# Altium schematic sheet Output.SchDoc
size Tabloid; SheetNumber: 4; SheetTotal: 5
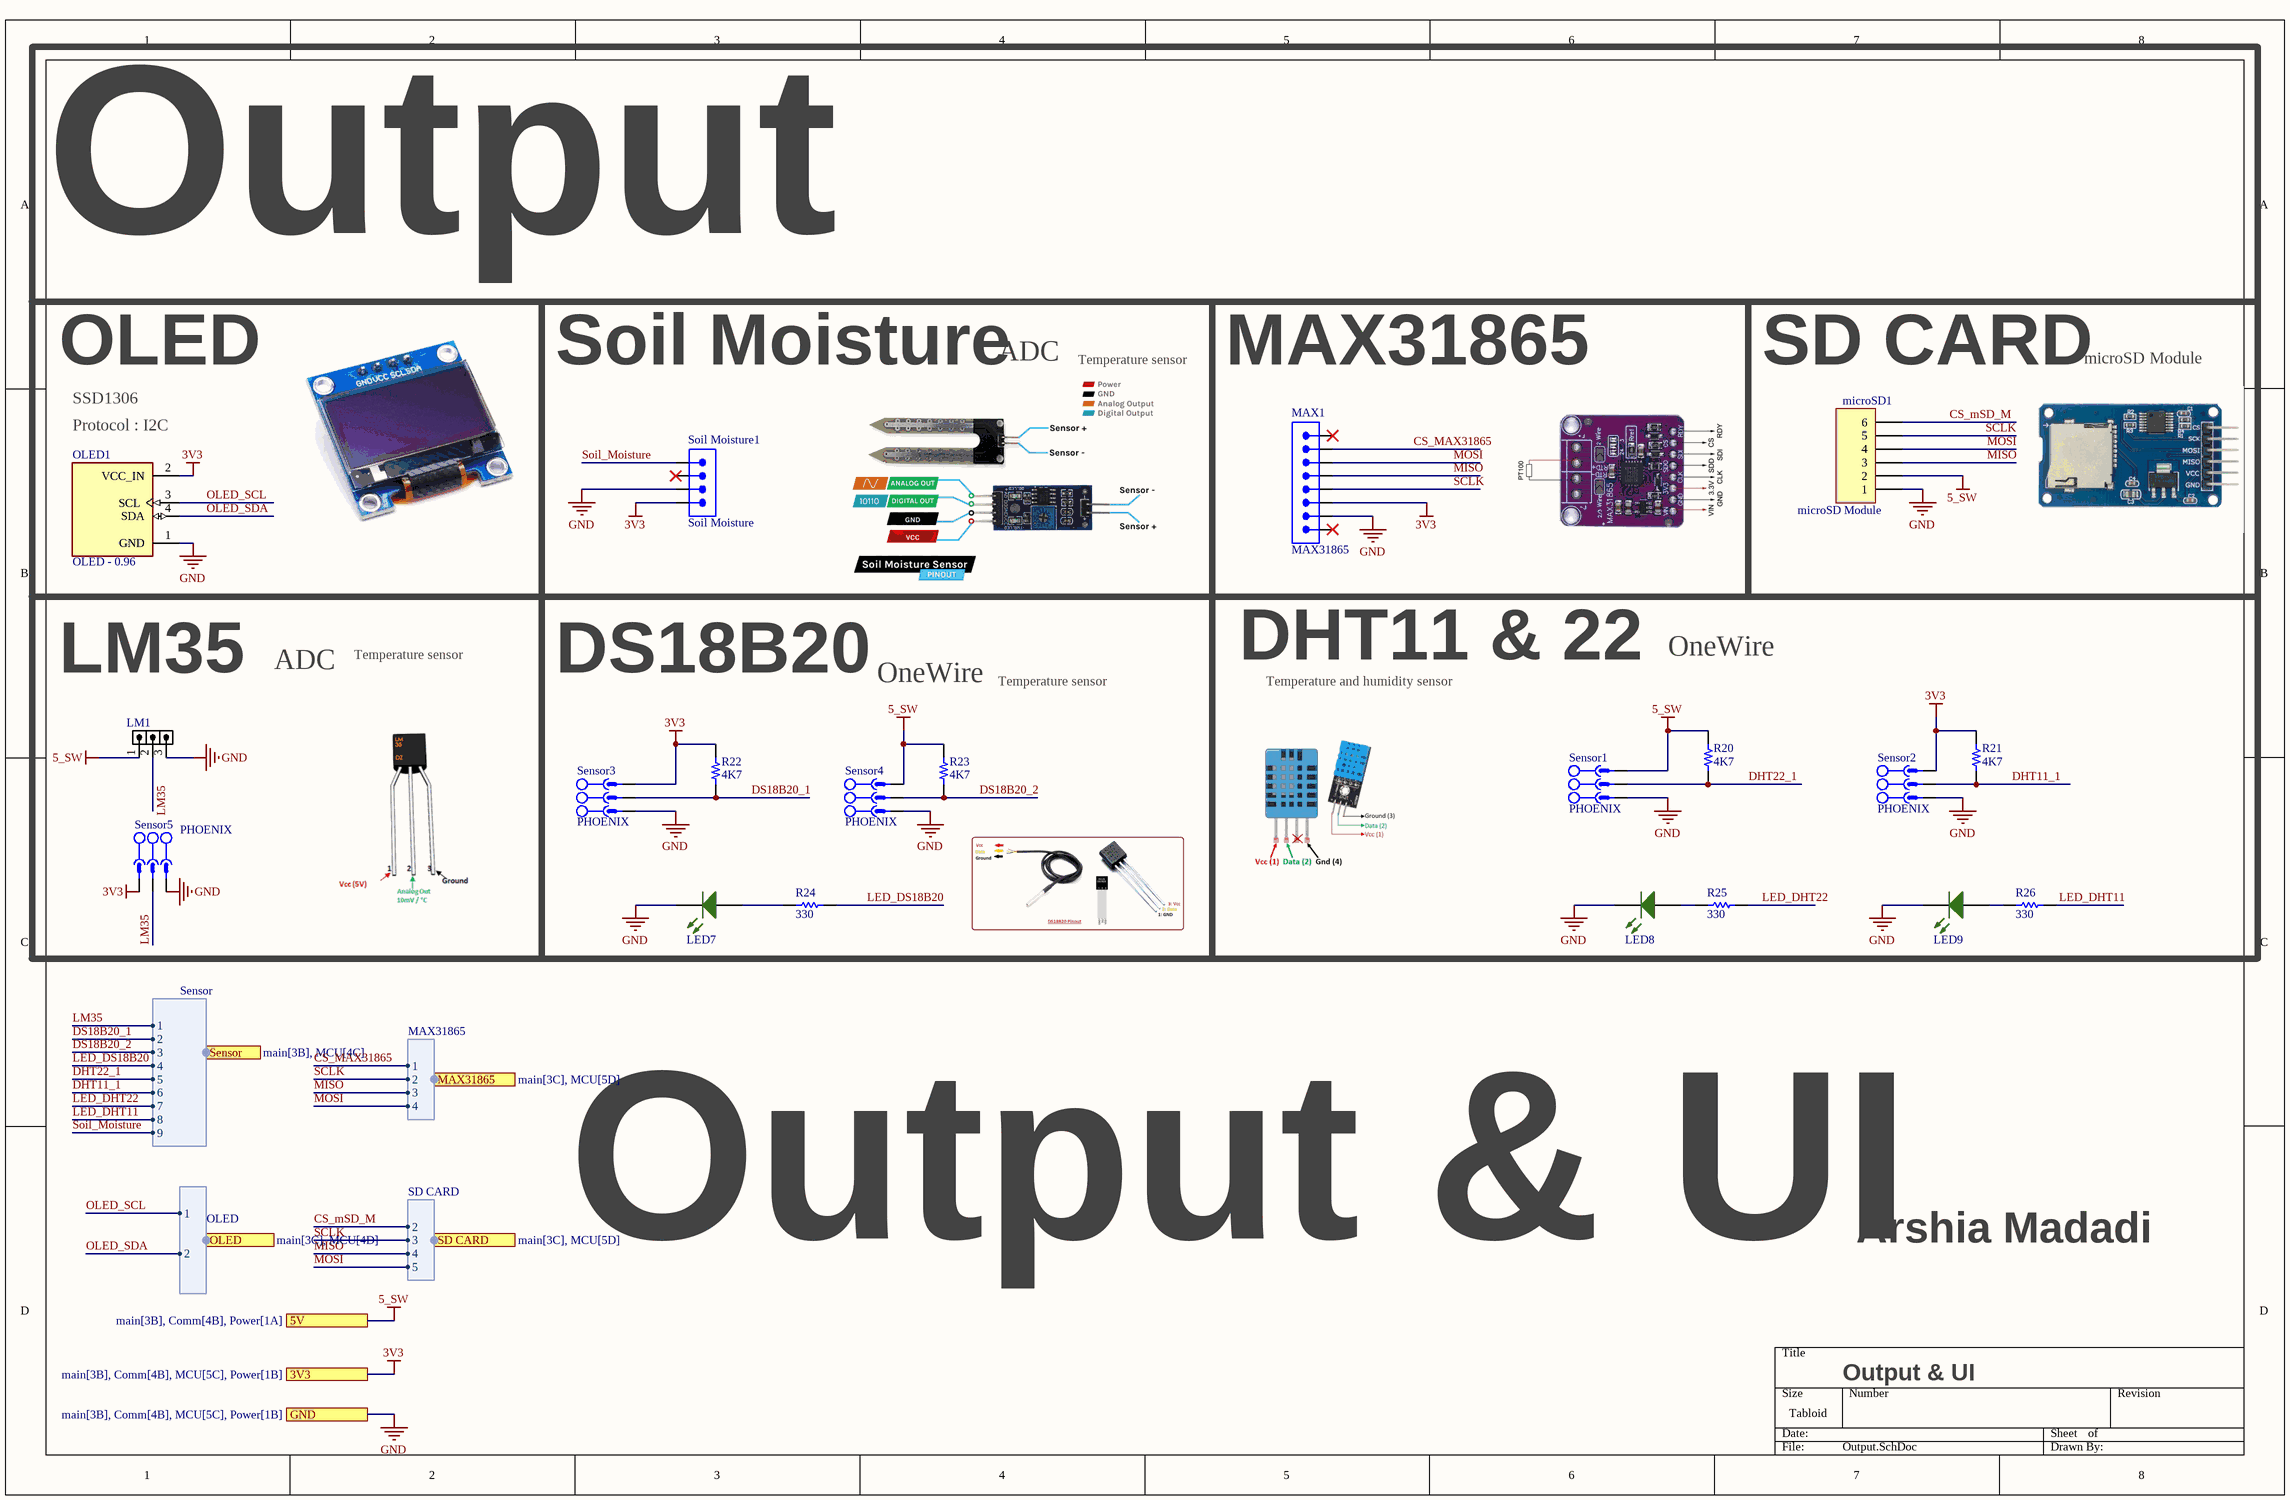
[diagram p0: Output.SchDoc]

## Parts
LED7  LED SMD 0805 GREEN  [LED_0805_GREEN]  (value not drawn)
LED8  LED SMD 0805 GREEN  [LED_0805_GREEN]  (value not drawn)
LED9  LED SMD 0805 GREEN  [LED_0805_GREEN]  (value not drawn)
LM1  HDRM3  [HDR_1X3]  (value not drawn)
MAX1  MAX31865  [MHDR1X08-254P]
microSD1  microSD Module  [HDR1X6-1]
OLED1  OLED - 0.96  [MODULE_DM-OLED096-636]
R20  4K7  [RES 0603_1608]
R21  4K7  [RES 0603_1608]
R22  4K7  [RES 0603_1608]
R23  4K7  [RES 0603_1608]
R24  330  [RESC3413X04N]
R25  330  [RESC3413X04N]
R26  330  [RESC3413X04N]
Sensor1  PHOENIX  [MSTB 2,5/3-G-5,08]
Sensor2  PHOENIX  [MSTB 2,5/3-G-5,08]
Sensor3  PHOENIX  [MSTB 2,5/3-G-5,08]
Sensor4  PHOENIX  [MSTB 2,5/3-G-5,08]
Sensor5  PHOENIX  [MSTB 2,5/3-G-5,08]
Soil_Moisture1  Soil Moisture  [MHDR1X04-254P]

## Blocks framed on the sheet
Output: OLED1
Soil Moisture: Soil_Moisture1
MAX31865: MAX1
LM35: LM1 Sensor5
DS18B20: LED7 R22-R24 Sensor3 Sensor4
DHT11 & 22: LED8 LED9 R20 R21 R25 R26 Sensor1 Sensor2

## Ports
3V3 (see main[3B], Comm[4B], MCU[5C], Power[1B]), 5V (see main[3B], Comm[4B], Power[1A]), GND (see main[3B], Comm[4B], MCU[5C], Power[1B]), MAX31865 (harness MAX31865, see main[3C], MCU[5D]), OLED (harness OLED, see main[3C], MCU[4D]), SD CARD (harness SD CARD, see main[3C], MCU[5D]), Sensor (harness Sensor, see main[3B], MCU[4C])

## Harnesses
Sensor: 1, 2, 3, 4, 5, 6, 7, 8, 9
MAX31865: 1, 2, 3, 4
SD CARD: 2, 3, 4, 5
OLED: 1, 2

## Nets
3V3: MAX1.6 OLED1.2(VCC_IN) R21.2 R22.2 Sensor2.1 Sensor3.1 Sensor5.3 Soil_Moisture1.4 ; port 3V3
5_SW: LM1.1 microSD1.2 R20.2 R23.2 Sensor1.1 Sensor4.1 ; port 5V
GND: LED7.2(K) LED8.1(A) LED9.2(K) LM1.3 MAX1.7 microSD1.1 OLED1.1(GND) Sensor1.3 Sensor2.3 Sensor3.3 Sensor4.3 Sensor5.1 Soil_Moisture1.3 ; port GND
CS_MAX31865: MAX1.2 ; port MAX31865.1
CS_mSD_M: microSD1.6 ; port SD CARD.2
DHT11_1: R21.1 Sensor2.2 ; port Sensor.6
DHT22_1: R20.1 Sensor1.2 ; port Sensor.5
DS18B20_1: R22.1 Sensor3.2 ; port Sensor.2
DS18B20_2: R23.1 Sensor4.2 ; port Sensor.3
LED_DHT11: R26.1 ; port Sensor.8
LED_DHT22: R25.1 ; port Sensor.7
LED_DS18B20: R24.1 ; port Sensor.4
LM35: LM1.2 Sensor5.2 ; port Sensor.1
MISO: MAX1.4 microSD1.3 ; port MAX31865.3, port SD CARD.4
MOSI: MAX1.3 microSD1.4 ; port MAX31865.4, port SD CARD.5
OLED_SCL: OLED1.3(SCL) ; port OLED.1
OLED_SDA: OLED1.4(SDA) ; port OLED.2
SCLK: MAX1.5 microSD1.5 ; port MAX31865.2, port SD CARD.3
Soil_Moisture: Soil_Moisture1.1 ; port Sensor.9
NetLED7_1: LED7.1(A) R24.2
NetLED8_2: LED8.2(K) R25.2
NetLED9_1: LED9.1(A) R26.2

Not connected (* = marked no-connect by the designer): MAX1 1* 8*; Soil_Moisture1 2*

## Notes on the sheet
- OLED
- ADC
- Temperature sensor
- (near microSD1) SD CARD
- microSD Module
- SSD1306
- (near OLED1) Protocol : I2C
- OneWire
- Temperature and humidity sensor
- Arshia Madadi
- Output & UI

## Library data of the parts
LM1 = HDR_1X3: CONN, HEADER, Male, pitch: 2.54mm, 3POS; VALUE: HDRM3
MAX1 = MHDR_1X08: Male Header 1X08
microSD1 = Header 6: Header, 6-Pin; LatestRevisionDate: 17-Jul-2002; LatestRevisionNote: Re-released for DXP Platform.; Publisher: Altium Limited
OLED1 = DM-OLED096-636: 0.96â€ 128 X 64 MONOCHROME GRAPHIC OLED DISPLAY MODULE - I2C; SnapEDA_Link: https://www.snapeda.com/parts/DM-OLED096-636/Display+Module/view-part/?ref=snap; Package: Package; Value: *; MF: Display Module; MP: DM-OLED096-636; Check_prices: https://www.snapeda.com/parts/DM-OLED096-636/Display+Module/view-part/?ref=eda
R20-R23 = Res 0603: VALUE: 1K
R24-R26 = RES 0805 0.125W: RES 0805; Designer: Abbas Basereh; Desc.: RES SMD 0805; Data: 16-12-2016
Sensor1-Sensor5 = CON_Phoenix_MSTB_03: 3 Pitch: 5.08 mm Color: green Contact surface: Tin Assembly; Manufacturer: PHOENIX CONTACT; Connector type: PCB Terminal Block; designer: ABBAS BASEREH; Max Current: 12 A; Positions: 3; Voltage: 320 V; Category: Connector; ComponentLink1Description: Header, Nominal current: 12 A Rated voltage (III/2): 320 V Number of positions: 3 Pitch: 5.08 mm Color: green Contact surface: Tin Assembly: Soldering  DESIGNER:ABBAS BASEREH; ComponentLink2Description: Reference; Mounting Technology: Through-Hole; Pin Count: 3; Revision 1: 2017-3-1; Status: Unreleased; PART.NO: PHOENIX
Soil_Moisture1 = MHDR_1X04: Male Header 1X04